# Altium schematic sheet Sunfish_ECU_CPU_RevA.SchDoc
size A3; _PRJ_TITLE: PROJECT TITLE; _SHT_TITLE: Sheet; _REV: A; PageSetup: Record=PageOptions|CenterHorizontal=True|CenterVertical=True|PrintScale=0.71|XCorrection=1.00|YCorrection=1.00|PrintKind=0|BorderSize=5000000|LeftOffset=0|BottomOffset=0|Orientation=2|PaperLength=1000|PaperWidth=1000|Scale=100|PaperSource=258|PrintQuality=600|MediaType=1|DitherType=10|PaperKind=A3 (297x420mm)|PrintScaleMode=1
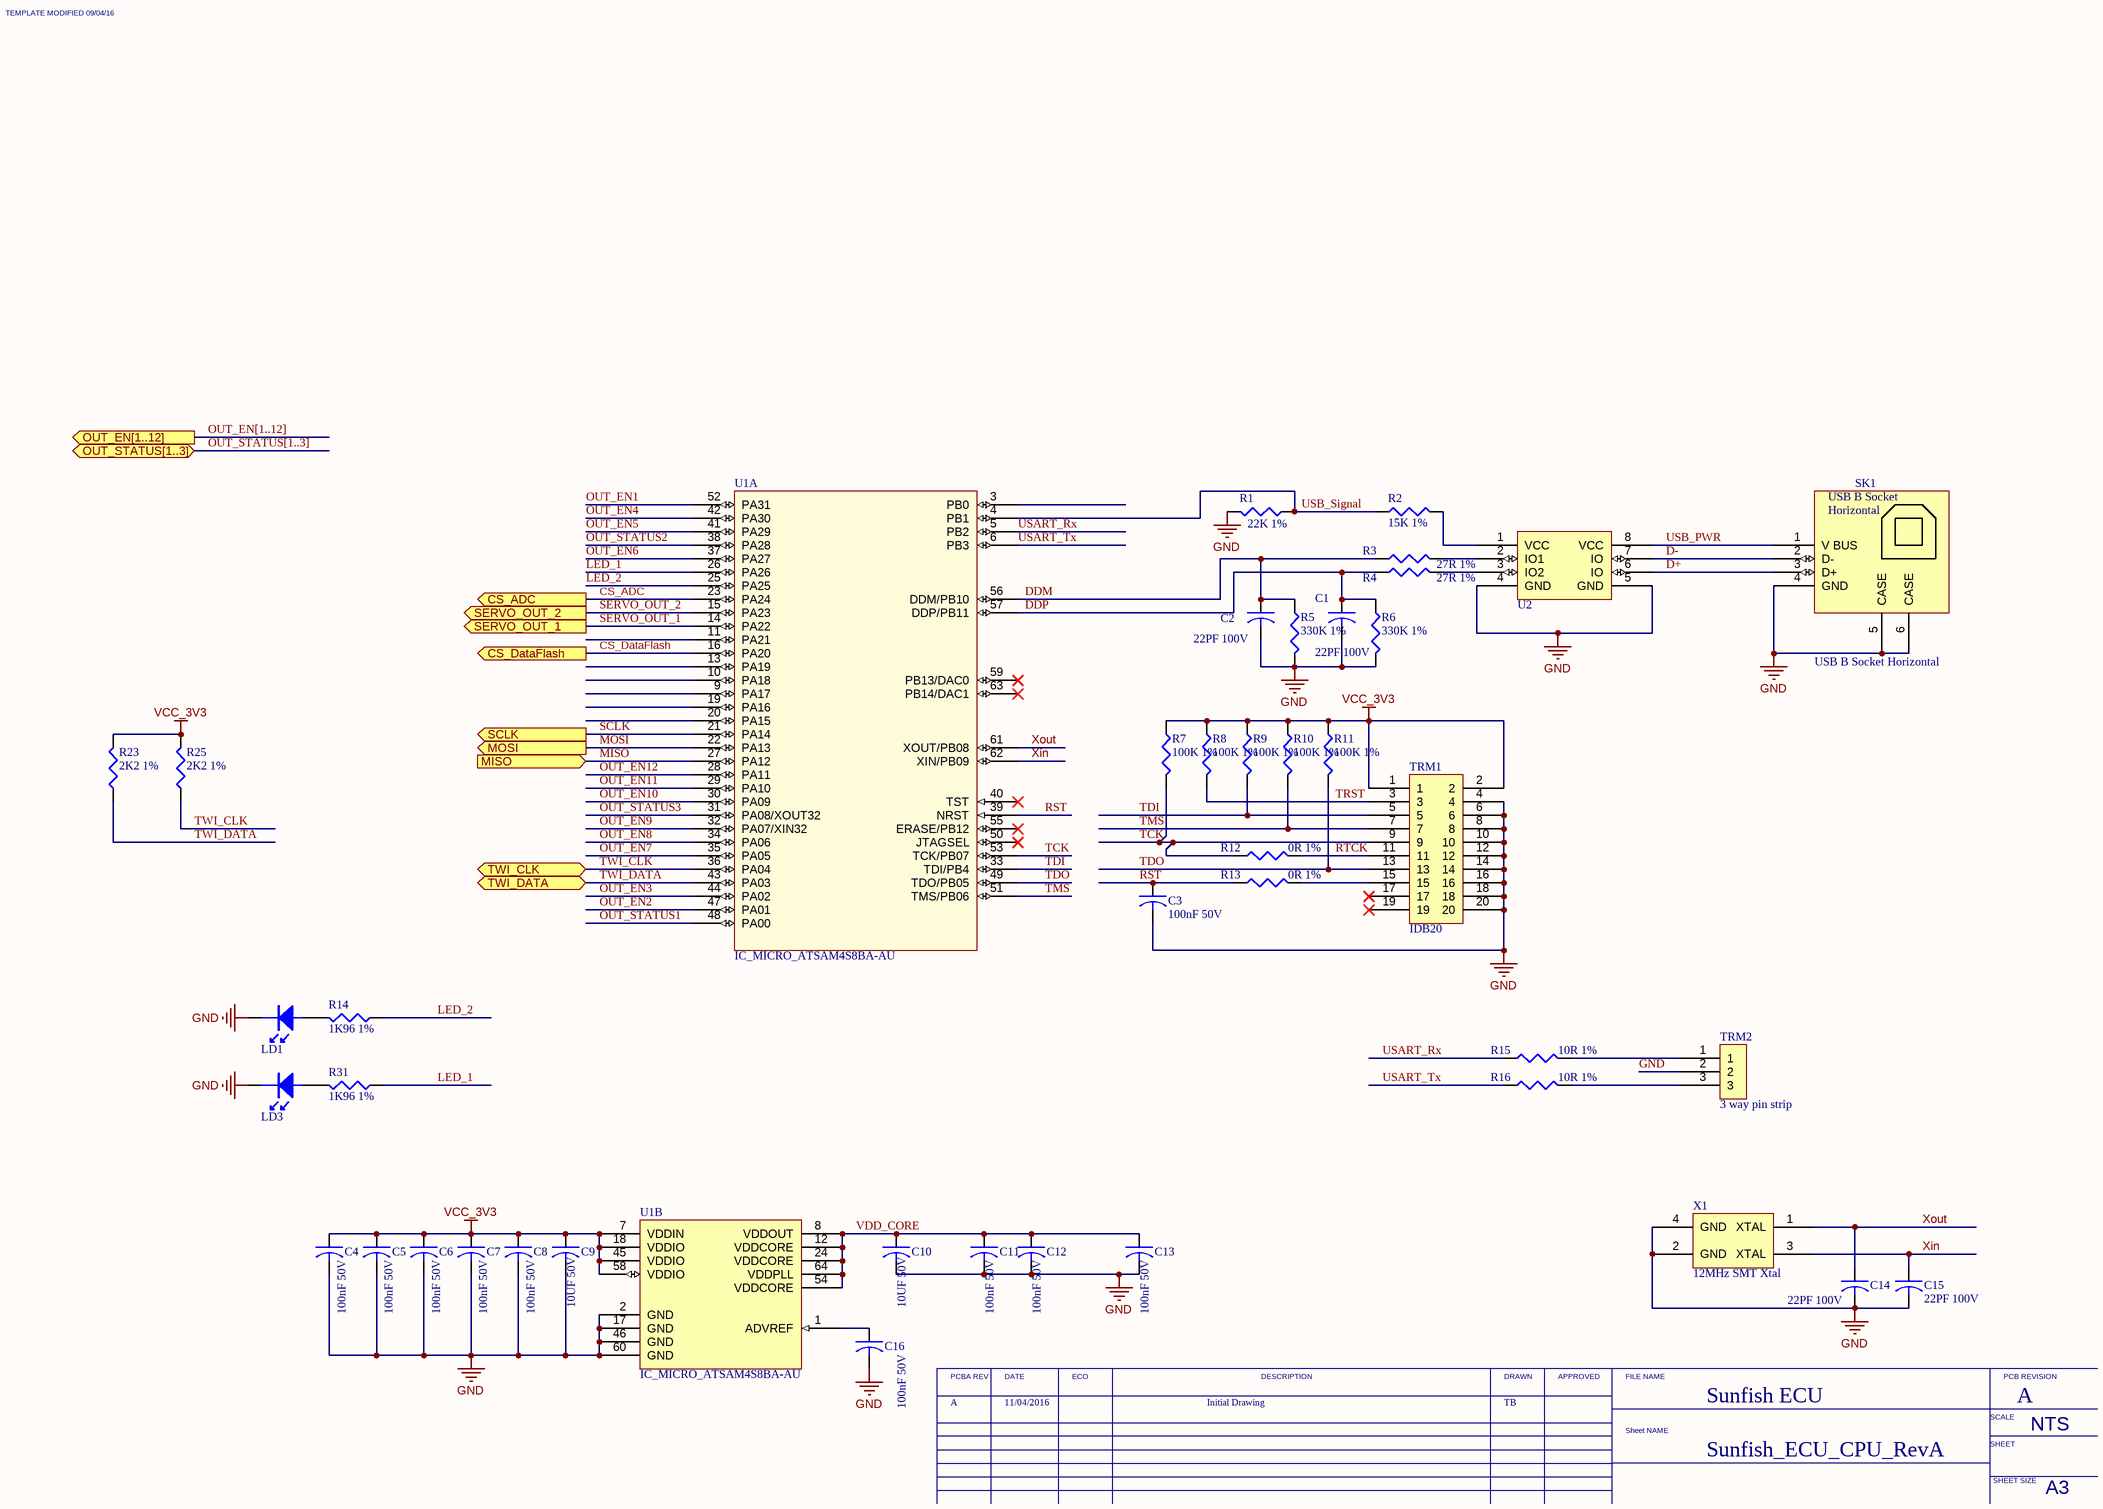
[diagram p0: Sunfish_ECU_CPU_RevA.SchDoc]

## Parts
C1  22PF 100V  [0603]
C2  22PF 100V  [0603]
C3  100nF 50V  [0603]
C4  100nF 50V  [0603]
C5  100nF 50V  [0603]
C6  100nF 50V  [0603]
C7  100nF 50V  [0603]
C8  100nF 50V  [0603]
C9  10UF 50V  [1206]
C10  10UF 50V  [1206]
C11  100nF 50V  [0603]
C12  100nF 50V  [0603]
C13  100nF 50V  [0603]
C14  22PF 100V  [0603]
C15  22PF 100V  [0603]
C16  100nF 50V  [0603]
LD1  Green LED 0805  [0805DIODE]  (value not drawn)
LD3  Green LED 0805  [0805DIODE]  (value not drawn)
R1  22K 1%  [0603]
R2  15K 1%  [0603]
R3  27R 1%  [0603]
R4  27R 1%  [0603]
R5  330K 1%  [0603]
R6  330K 1%  [0603]
R7  100K 1%  [0603]
R8  100K 1%  [0603]
R9  100K 1%  [0603]
R10  100K 1%  [0603]
R11  100K 1%  [0603]
R12  0R 1%  [0603]
R13  0R 1%  [0603]
R14  1K96 1%  [0603]
R15  10R 1%  [0603]
R16  10R 1%  [0603]
R23  2K2 1%  [0603]
R25  2K2 1%  [0603]
R31  1K96 1%  [0603]
SK1  USB B Socket Horizontal  [USB_B_Horizontal]
TRM1  IDB20  [IDC20_BOXED]
TRM2  3 way pin strip  [SIP_3]
U1  IC_MICRO_ATSAM4S8BA-AU  [TSQFP50P1200X1200X160-64M]  (parts A,B of 2)
U2  IC_USB_Transorb  [SO-8]  (value not drawn)
X1  12MHz SMT Xtal  [XTAL_5X3.2_SMD]

## Ports
CS_ADC (out), CS_DataFlash (out), MISO (in), MOSI (out), OUT_EN[1..12] (out), OUT_STATUS[1..3] (bidir), SCLK (out), SERVO_OUT_1 (out), SERVO_OUT_2 (out), TWI_CLK (bidir), TWI_DATA (bidir)

## Nets
GND: C1.2 C2.2 C3.2 C4.2 C5.2 C6.2 C7.2 C8.2 C9.2 C10.2 C11.2 C12.2 C13.2 C14.2 C15.2 C16.2 LD1.K LD3.K R1.1 R5.1 R6.1 SK1.4(GND) SK1.5(CASE) SK1.6(CASE) TRM1.4 TRM1.6 TRM1.8 TRM1.10 TRM1.12 TRM1.14 TRM1.16 TRM1.18 TRM1.20 TRM2.2 U1.2(GND) U1.17(GND) U1.46(GND) U1.60(GND) U2.4(GND) U2.5(GND) X1.2(GND) X1.4(GND)
VCC_3V3: C4.1 C5.1 C6.1 C7.1 C8.1 C9.1 R7.2 R8.2 R9.2 R10.2 R11.2 R23.2 R25.2 TRM1.1 TRM1.2 U1.7(VDDIN) U1.18(VDDIO) U1.45(VDDIO) U1.58(VDDIO)
CS_ADC: U1.23(PA24) ; port CS_ADC
CS_DataFlash: U1.16(PA20) ; port CS_DataFlash
D+: SK1.3(D+) U2.6(IO)
D-: SK1.2(D-) U2.7(IO)
DDM: C2.1 R3.2 R5.2 U1.56(DDM/PB10)
DDP: C1.1 R4.2 R6.2 U1.57(DDP/PB11)
LED_1: R31.1 U1.26(PA26)
LED_2: R14.1 U1.25(PA25)
MISO: U1.27(PA12) ; port MISO
MOSI: U1.22(PA13) ; port MOSI
OUT_EN1: U1.52(PA31)
OUT_EN2: U1.47(PA01)
OUT_EN3: U1.44(PA02)
OUT_EN4: U1.42(PA30)
OUT_EN5: U1.41(PA29)
OUT_EN6: U1.37(PA27)
OUT_EN7: U1.35(PA05)
OUT_EN8: U1.34(PA06)
OUT_EN9: U1.32(PA07/XIN32)
OUT_EN10: U1.30(PA09)
OUT_EN11: U1.29(PA10)
OUT_EN12: U1.28(PA11)
OUT_STATUS1: U1.48(PA00)
OUT_STATUS2: U1.38(PA28)
OUT_STATUS3: U1.31(PA08/XOUT32)
RST: C3.1 R13.2 U1.39(NRST)
RTCK: R12.1 TRM1.11
SCLK: U1.21(PA14) ; port SCLK
SERVO_OUT_1: U1.14(PA22) ; port SERVO_OUT_1
SERVO_OUT_2: U1.15(PA23) ; port SERVO_OUT_2
TCK: R7.1 R12.2 TRM1.9 U1.53(TCK/PB07)
TDI: R9.1 TRM1.5 U1.33(TDI/PB4)
TDO: R11.1 TRM1.13 U1.49(TDO/PB05)
TMS: R10.1 TRM1.7 U1.51(TMS/PB06)
TRST: R8.1 TRM1.3
TWI_CLK: R25.1 U1.36(PA04) ; port TWI_CLK
TWI_DATA: R23.1 U1.43(PA03) ; port TWI_DATA
USART_Rx: R15.1 U1.5(PB2)
USART_Tx: R16.1 U1.6(PB3)
USB_PWR: SK1.1(V_BUS) U2.8(VCC)
USB_Signal: R1.2 R2.2 U1.4(PB1)
VDD_CORE: C10.1 C11.1 C12.1 C13.1 U1.8(VDDOUT) U1.12(VDDCORE) U1.24(VDDCORE) U1.54(VDDCORE) U1.64(VDDPLL)
Xin: C15.1 U1.62(XIN/PB09) X1.3(XTAL)
Xout: C14.1 U1.61(XOUT/PB08) X1.1(XTAL)
NetC16_1: C16.1 U1.1(ADVREF)
NetLD1_A: LD1.A R14.2
NetLD3_A: LD3.A R31.2
NetR2_1: R2.1 U2.1(VCC)
NetR3_1: R3.1 U2.2(IO1)
NetR4_1: R4.1 U2.3(IO2)
NetR13_1: R13.1 TRM1.15
NetR15_2: R15.2 TRM2.1
NetR16_2: R16.2 TRM2.3

Not connected (* = marked no-connect by the designer): TRM1 17* 19*; U1 3(PB0) 9(PA17) 10(PA18) 11(PA21) 13(PA19) 19(PA16) 20(PA15) 40(TST)* 50(JTAGSEL)* 55(ERASE/PB12)* 59(PB13/DAC0)* 63(PB14/DAC1)*

## Buses and harness runs
bus OUT_EN[1..12] = port OUT_EN[1..12]
bus OUT_STATUS[1..3] = port OUT_STATUS[1..3]

## Notes on the sheet
- A
- 11/04/2016
- Initial Drawing
- TB
- Sunfish ECU
- Sunfish_ECU_CPU_RevA
- TEMPLATE MODIFIED 09/04/16
- PCBA REV
- DATE
- ECO
- DESCRIPTION
- DRAWN
- APPROVED
- FILE NAME
- PCB REVISION
- Sheet NAME
- SCALE
- SHEET
- NTS
- SHEET SIZE
- A3
- (in symbol USB_B_Horizontal) USB B Socket; Horizontal

## Library data of the parts
C1 C2 C14 C15 = CAP_22PF_100V_5%_0603: CAP CER 22PF 100V 5% NP0 0603; Manufacturer: Murata; Manufacturer P/N: GRM1885C2A220JA01D
C3-C8 C11-C13 C16 = CAP_100NF_50V_10%_0603: CAP CER 100nF 50V 10% X7R 0603; Manufacturer: Murata; Manufacturer P/N: GRM188R71H104KA93D
C9 C10 = CAP_10UF_50V_10%_1206: CAP CER 10UF 50V 10% X5R 1206; Manufacturer: Murata; Manufacturer P/N: GRM31CR61H106KA12L
LD1 LD3 = LED_Green_0805: WL-SMCW SMD CHIP LED WATERCLEAR; Manufacturer: Wurth; Manufacturer P/N: 150080VS75000
R1 = RES_22K_1%_0603: Resistor, 22K, 1%, 0603; Manufacturer: Bourns Inc; Manufacturer P/N: CR0603-FX-2202ELF
R2 = RES_15K_1%_0603: Resistor, 15K, 1%, 0603; Manufacturer: Bourns Inc; Manufacturer P/N: CR0603-FX-1502ELF
R3 R4 = RES_27R_1%_0603: Resistor, 27R, 1%, 0603; Manufacturer: Bourns Inc; Manufacturer P/N: CR0603-FX-27R0ELF
R5 R6 = RES_330K_1%_0603: Resistor, 330K, 1%, 0603; Manufacturer: Bourns Inc; Manufacturer P/N: CR0603-FX-3303ELF
R7-R11 = RES_100K_1%_0603: Resistor, 100K, 1%, 0603; Manufacturer: Bourns Inc; Manufacturer P/N: CRT0603-BY-1003ELF
R12 R13 = RES_0R_1%_0603: Resistor, 0R, 1%, 0603; Manufacturer: Bourns Inc; Manufacturer P/N: CR0603-J/-000ELF
R14 R31 = RES_1K96_1%_0603: Resistor, 1K96, 1%, 0603; Manufacturer: Yageo; Manufacturer P/N: RC0603FR-071K96L
R15 R16 = RES_10R_1%_0603: Resistor, 10R, 1%, 0603; Manufacturer: Bourns Inc; Manufacturer P/N: CR0603-FX-10R0ELF
R23 R25 = RES_2K2_1%_0603: Resistor, 2K2, 1%, 0603; Manufacturer: Bourns Inc; Manufacturer P/N: CR0603-FX-2201ELF
SK1 = USB_B_Horizontal: Manufacturer: Wurth Electronics Inc; Manufacturer P/N: 61400416121
TRM1 = TRM_IDC20: IDC BOX HEADER .100" 20POS; Manufacturer: CNC Tech; Manufacturer P/N: 3020-20-0100-00
TRM2 = TRM_3WaySocket: Manufacturer: N/A; Manufacturer P/N: N/A
U1 = IC_MICRO_ATSAM4S8BA-AU: 64 Pin, 512KB Flash, 128K SRAM; Manufacturer: Atmel; Manufacturer P/N: ATSAM4S8BA-AU
U2 = IC_USB_Transorb: TVS DIODE 5.25VWM 8SOIC; Manufacturer: STMicroelectronics; Manufacturer P/N: USB6B1RL
X1 = XTAL_12MHZ_SMT: Crystal 12.0000MHz 30ppm 12pF 40 Ohm -20°C - 70°C Surface Mount 4-SMD, No Lead (DFN, LCC); Manufacturer: TXC CORPORATION; Manufacturer P/N: 7B-12.000MAAE-T